# EAGLE schematic Solenoids (EAGLE 6.6.0)
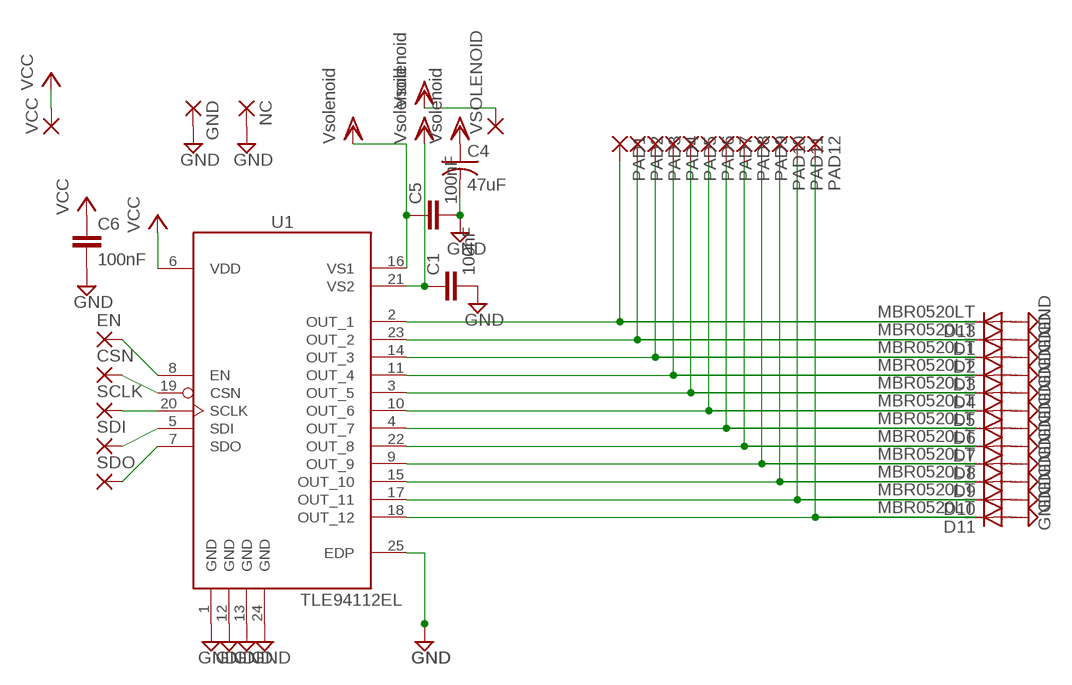
[diagram p0: schematic, sheet 1]

## Parts
C1  100nF  C-EUC0402K  [C0402K]
C4  47uF  C-US050-045X075  [C050-045X075]
C5  100nF  C-EUC0402K  [C0402K]
C6  100nF  C-EUC0402K  [C0402K]
CSN  1,6/0,8  [1,6/0,8]
D1  MBR0520LT  [SOD123]
D2  MBR0520LT  [SOD123]
D3  MBR0520LT  [SOD123]
D4  MBR0520LT  [SOD123]
D5  MBR0520LT  [SOD123]
D6  MBR0520LT  [SOD123]
D7  MBR0520LT  [SOD123]
D8  MBR0520LT  [SOD123]
D9  MBR0520LT  [SOD123]
D10  MBR0520LT  [SOD123]
D11  MBR0520LT  [SOD123]
D13  MBR0520LT  [SOD123]
EN  1,6/0,8  [1,6/0,8]
GND  1,6/0,8  [1,6/0,8]
NC  1,6/0,8  [1,6/0,8]
PAD1  1,6/0,8  [1,6/0,8]
PAD2  1,6/0,8  [1,6/0,8]
PAD3  1,6/0,8  [1,6/0,8]
PAD4  1,6/0,8  [1,6/0,8]
PAD5  1,6/0,8  [1,6/0,8]
PAD6  1,6/0,8  [1,6/0,8]
PAD7  1,6/0,8  [1,6/0,8]
PAD8  1,6/0,8  [1,6/0,8]
PAD9  1,6/0,8  [1,6/0,8]
PAD10  1,6/0,8  [1,6/0,8]
PAD11  1,6/0,8  [1,6/0,8]
PAD12  1,6/0,8  [1,6/0,8]
SCLK  1,6/0,8  [1,6/0,8]
SDI  1,6/0,8  [1,6/0,8]
SDO  1,6/0,8  [1,6/0,8]
U1  TLE94112EL  [SOP65P600X170-25N]
VCC  1,6/0,8  [1,6/0,8]
VSOLENOID  1,6/0,8  [1,6/0,8]

## Nets
GND: C1.2 C4.2 C5.2 C6.2 D1.A D2.A D3.A D4.A D5.A D6.A D7.A D8.A D9.A D10.A D11.A D13.A GND.1(P) NC.1(P) U1.1(GND) U1.12(GND) U1.13(GND) U1.24(GND) U1.25(EDP)
N$1 [Solenoids]: D13.C PAD1.1(P) U1.2(OUT_1)
N$2 [Solenoids]: D1.C PAD2.1(P) U1.23(OUT_2)
N$3 [Solenoids]: D2.C PAD3.1(P) U1.14(OUT_3)
N$4 [Solenoids]: D3.C PAD4.1(P) U1.11(OUT_4)
N$5 [Solenoids]: D4.C PAD5.1(P) U1.3(OUT_5)
N$6 [Solenoids]: D5.C PAD6.1(P) U1.10(OUT_6)
N$7 [Solenoids]: D6.C PAD7.1(P) U1.4(OUT_7)
N$8 [Solenoids]: D7.C PAD8.1(P) U1.22(OUT_8)
N$9 [Solenoids]: D8.C PAD9.1(P) U1.9(OUT_9)
N$10 [Solenoids]: D9.C PAD10.1(P) U1.15(OUT_10)
N$11 [Solenoids]: D10.C PAD11.1(P) U1.17(OUT_11)
N$12 [Solenoids]: D11.C PAD12.1(P) U1.18(OUT_12)
N$22: EN.1(P) U1.8(EN)
N$23: CSN.1(P) U1.19(CSN)
N$24: SCLK.1(P) U1.20(SCLK)
N$25: SDI.1(P) U1.5(SDI)
N$26: SDO.1(P) U1.7(SDO)
VCC: C6.1 U1.6(VDD) VCC.1(P)
VDD: C1.1 C4.1 C5.1 U1.16(VS1) U1.21(VS2) VSOLENOID.1(P) ; supply symbol labelled Vsolenoid

## Library data of the parts
C1 C5 C6 = rcl:C-EU: CAPACITOR, European symbol
C4 = rcl:C-US: CAPACITOR, American symbol
CSN EN GND NC PAD1-PAD12 SCLK SDI SDO VCC VSOLENOID = wirepad:1,6/0,8: THROUGH-HOLE PAD
D1-D11 D13 = diode:MBR0520LT: SCHOTTKY BARRIER RECTIFIER Source: http://onsemi.com .. MBR0520LT1-D.pdf
U1 = TLE94112EL:TLE94112EL: TLE94112EL Protected Twelve-Fold Half-Bridge Driver Package: PG-SSOP-24-4, -9-PO V01

## Net classes
1 Solenoids: width 0.406 mm